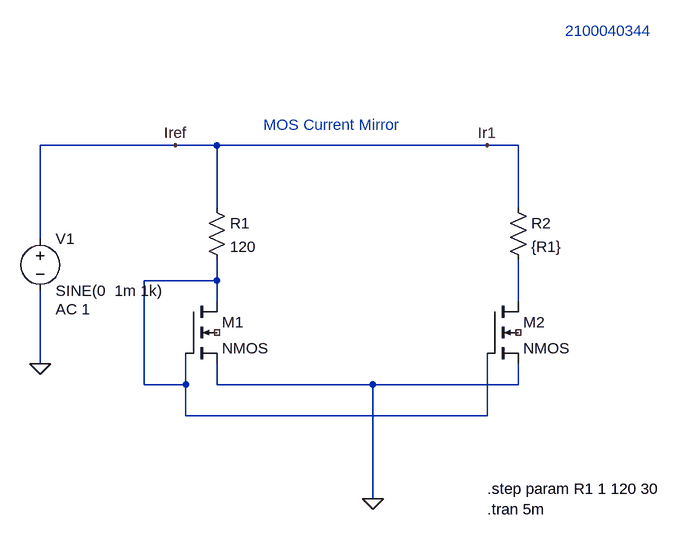
[diagram p0: schematic MOS Current Mirror.asc]
MOS Current Mirror.asc, the LTspice schematic file:
Version 4
SHEET 1 936 680
WIRE 48 -80 -160 -80
WIRE 112 -80 48 -80
WIRE 528 -80 112 -80
WIRE 576 -80 528 -80
WIRE 112 16 112 -80
WIRE 576 16 576 -80
WIRE -160 64 -160 -80
WIRE 112 128 112 96
WIRE 112 128 0 128
WIRE 112 160 112 128
WIRE 576 160 576 96
WIRE -160 256 -160 144
WIRE 0 288 0 128
WIRE 64 288 64 240
WIRE 64 288 0 288
WIRE 112 288 112 256
WIRE 352 288 112 288
WIRE 576 288 576 256
WIRE 576 288 352 288
WIRE 64 336 64 288
WIRE 528 336 528 240
WIRE 528 336 64 336
WIRE 352 464 352 288
FLAG 352 464 0
FLAG -160 256 0
FLAG 48 -80 Iref
FLAG 528 -80 Ir1
SYMBOL nmos4 64 160 R0
SYMATTR InstName M1
SYMBOL nmos4 528 160 R0
SYMATTR InstName M2
SYMBOL voltage -160 48 R0
WINDOW 123 24 124 Left 2
WINDOW 39 0 0 Left 0
SYMATTR Value2 AC 1
SYMATTR InstName V1
SYMATTR Value SINE(0  1m 1k)
SYMBOL res 96 0 R0
SYMATTR InstName R1
SYMATTR Value 120
SYMBOL res 560 0 R0
SYMATTR InstName R2
SYMATTR Value {R1}
TEXT 184 -112 Left 2 ;MOS Current Mirror
TEXT 528 448 Left 2 !.step param R1 1 120 30
TEXT 528 480 Left 2 !.tran 5m
TEXT 648 -256 Left 2 ;2100040344

The netlist it stands for:
* MOS Current Mirror.asc
M1 N001 N001 0 NC_01 NMOS
M2 N002 N001 0 NC_02 NMOS
V1 Ir1 0 SINE(0  1m 1k) AC 1
R1 Ir1 N001 120
R2 Ir1 N002 {R1}
.model NMOS NMOS
.model PMOS PMOS
.lib standard.mos
* MOS Current Mirror
.step param R1 1 120 30
.tran 5m
* 2100040344
.backanno
.end